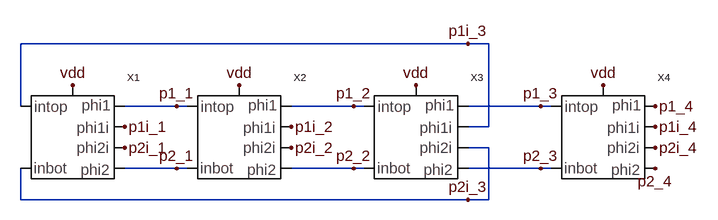
[diagram p0: schematic clock_gen.asc]
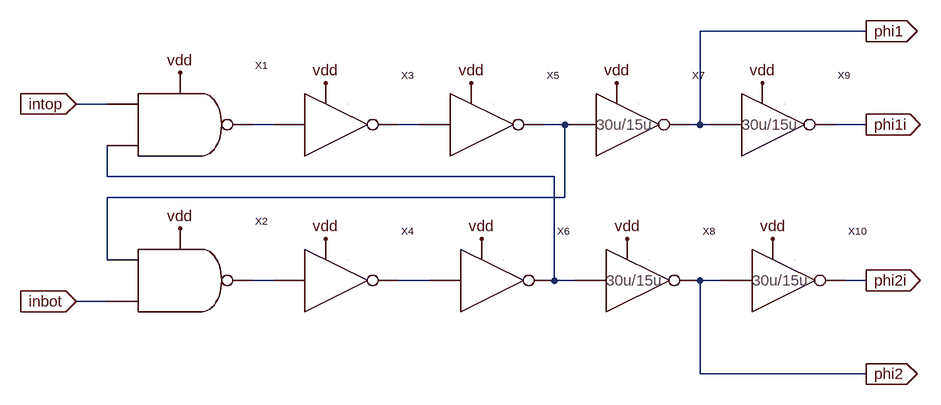
[diagram p1: sub-circuit delay.asc]
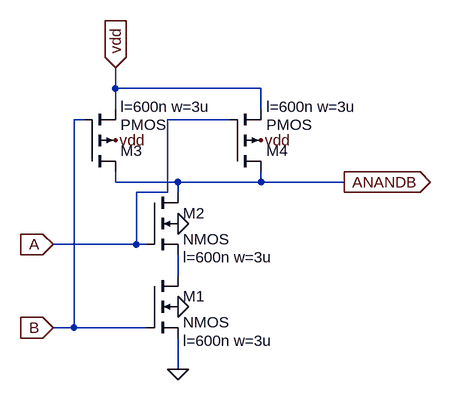
[diagram p2: sub-circuit nand_2.asc]
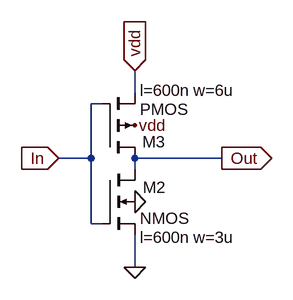
[diagram p3: sub-circuit inv_6u_3u.asc]
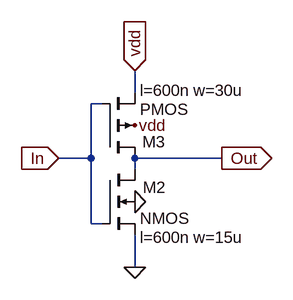
[diagram p4: sub-circuit inv_30u_15u.asc]
clock_gen.asc, the LTspice schematic file:
Version 4
SHEET 1 1048 680
WIRE 672 32 -16 32
WIRE 704 32 672 32
WIRE 704 160 704 32
WIRE -16 128 -16 32
WIRE 224 128 144 128
WIRE 240 128 224 128
WIRE 496 128 400 128
WIRE 512 128 496 128
WIRE 784 128 672 128
WIRE 800 128 784 128
WIRE 704 160 672 160
WIRE 704 192 672 192
WIRE 224 224 144 224
WIRE 240 224 224 224
WIRE 496 224 400 224
WIRE 512 224 496 224
WIRE 784 224 672 224
WIRE 800 224 784 224
WIRE -16 272 -16 224
WIRE 672 272 -16 272
WIRE 704 272 704 192
WIRE 704 272 672 272
FLAG 64 96 vdd
FLAG 320 96 vdd
FLAG 592 96 vdd
FLAG 880 96 vdd
FLAG 224 128 p1_1
FLAG 496 128 p1_2
FLAG 784 128 p1_3
FLAG 960 128 p1_4
FLAG 144 160 p1i_1
FLAG 400 160 p1i_2
FLAG 672 32 p1i_3
FLAG 960 160 p1i_4
FLAG 144 192 p2i_1
FLAG 400 192 p2i_2
FLAG 672 272 p2i_3
FLAG 960 192 p2i_4
FLAG 224 224 p2_1
FLAG 496 224 p2_2
FLAG 784 224 p2_3
FLAG 960 224 p2_4
SYMBOL delay 64 176 R0
SYMATTR InstName X1
SYMBOL delay 320 176 R0
SYMATTR InstName X2
SYMBOL delay 592 176 R0
SYMATTR InstName X3
SYMBOL delay 880 176 R0
SYMATTR InstName X4

delay.asc, the sub-circuit schematic file:
Version 4
SHEET 1 1340 680
WIRE 1216 -16 960 -16
WIRE 48 96 0 96
WIRE 304 128 272 128
WIRE 528 128 496 128
WIRE 752 128 720 128
WIRE 960 128 960 -16
WIRE 960 128 944 128
WIRE 976 128 960 128
WIRE 1216 128 1168 128
WIRE 48 208 48 160
WIRE 736 208 48 208
WIRE 752 240 752 128
WIRE 752 240 48 240
WIRE 48 336 48 240
WIRE 304 368 272 368
WIRE 544 368 496 368
WIRE 736 368 736 208
WIRE 768 368 736 368
WIRE 992 368 960 368
WIRE 1216 368 1184 368
WIRE 48 400 0 400
WIRE 960 512 960 368
WIRE 1216 512 960 512
FLAG 384 64 vdd
FLAG 160 48 vdd
FLAG 608 64 vdd
FLAG 624 304 vdd
FLAG 384 304 vdd
FLAG 160 288 vdd
FLAG 832 64 vdd
FLAG 1056 64 vdd
FLAG 848 304 vdd
FLAG 1072 304 vdd
FLAG 1216 -16 phi1
IOPIN 1216 -16 Out
FLAG 1216 128 phi1i
IOPIN 1216 128 Out
FLAG 1216 368 phi2i
IOPIN 1216 368 Out
FLAG 1216 512 phi2
IOPIN 1216 512 Out
FLAG 0 96 intop
IOPIN 0 96 In
FLAG 0 400 inbot
IOPIN 0 400 In
SYMBOL NAND_2 80 128 R0
SYMATTR InstName X1
SYMBOL NAND_2 80 368 R0
SYMATTR InstName X2
SYMBOL Inv_6u_3u 304 128 R0
SYMATTR InstName X3
SYMBOL Inv_6u_3u 304 368 R0
SYMATTR InstName X4
SYMBOL Inv_6u_3u 528 128 R0
SYMATTR InstName X5
SYMBOL Inv_6u_3u 544 368 R0
SYMATTR InstName X6
SYMBOL Inv_30u_15u 752 128 R0
SYMATTR InstName X7
SYMBOL Inv_30u_15u 768 368 R0
SYMATTR InstName X8
SYMBOL Inv_30u_15u 976 128 R0
SYMATTR InstName X9
SYMBOL Inv_30u_15u 992 368 R0
SYMATTR InstName X10

nand_2.asc, the sub-circuit schematic file:
Version 4
SHEET 1 880 680
WIRE 176 -96 176 -128
WIRE 400 -96 176 -96
WIRE 176 -64 176 -96
WIRE 400 -64 400 -96
WIRE 128 -48 112 -48
WIRE 352 -48 256 -48
WIRE 176 48 176 32
WIRE 272 48 176 48
WIRE 400 48 400 32
WIRE 400 48 272 48
WIRE 528 48 400 48
WIRE 256 64 256 -48
WIRE 256 64 208 64
WIRE 272 64 272 48
WIRE 208 144 208 64
WIRE 208 144 80 144
WIRE 224 144 208 144
WIRE 272 192 272 160
WIRE 112 272 112 -48
WIRE 112 272 80 272
WIRE 224 272 112 272
WIRE 272 336 272 288
FLAG 272 336 0
FLAG 272 240 0
FLAG 272 112 0
FLAG 80 144 A
IOPIN 80 144 In
FLAG 80 272 B
IOPIN 80 272 In
FLAG 176 -128 vdd
IOPIN 176 -128 In
FLAG 176 -16 vdd
FLAG 400 -16 vdd
FLAG 528 48 ANANDB
IOPIN 528 48 Out
SYMBOL nmos4 224 192 R0
WINDOW 123 56 100 Left 2
SYMATTR InstName M1
SYMATTR Value2 l=600n w=3u
SYMBOL nmos4 224 64 R0
WINDOW 123 56 100 Left 2
SYMATTR InstName M2
SYMATTR Value2 l=600n w=3u
SYMBOL pmos4 128 32 M180
WINDOW 123 56 100 Left 2
SYMATTR InstName M3
SYMATTR Value2 l=600n w=3u
SYMBOL pmos4 352 32 M180
WINDOW 123 56 100 Left 2
SYMATTR InstName M4
SYMATTR Value2 l=600n w=3u

inv_6u_3u.asc, the sub-circuit schematic file:
Version 4
SHEET 1 880 680
WIRE 272 -48 272 -80
WIRE 224 -32 208 -32
WIRE 208 48 208 -32
WIRE 208 48 160 48
WIRE 400 48 272 48
WIRE 272 64 272 48
WIRE 208 144 208 48
WIRE 224 144 208 144
WIRE 272 208 272 160
FLAG 272 208 0
FLAG 272 112 0
FLAG 160 48 In
IOPIN 160 48 In
FLAG 272 -80 vdd
IOPIN 272 -80 In
FLAG 272 0 vdd
FLAG 400 48 Out
IOPIN 400 48 Out
SYMBOL nmos4 224 64 R0
WINDOW 123 56 100 Left 2
WINDOW 0 60 27 Left 2
SYMATTR Value2 l=600n w=3u
SYMATTR InstName M2
SYMBOL pmos4 224 48 M180
WINDOW 123 56 100 Left 2
WINDOW 0 59 24 Left 2
SYMATTR Value2 l=600n w=6u
SYMATTR InstName M3

inv_30u_15u.asc, the sub-circuit schematic file:
Version 4
SHEET 1 880 680
WIRE 272 -48 272 -80
WIRE 224 -32 208 -32
WIRE 208 48 208 -32
WIRE 208 48 160 48
WIRE 400 48 272 48
WIRE 272 64 272 48
WIRE 208 144 208 48
WIRE 224 144 208 144
WIRE 272 208 272 160
FLAG 272 208 0
FLAG 272 112 0
FLAG 160 48 In
IOPIN 160 48 In
FLAG 272 -80 vdd
IOPIN 272 -80 In
FLAG 272 0 vdd
FLAG 400 48 Out
IOPIN 400 48 Out
SYMBOL nmos4 224 64 R0
WINDOW 123 56 100 Left 2
WINDOW 0 60 27 Left 2
SYMATTR Value2 l=600n w=15u
SYMATTR InstName M2
SYMBOL pmos4 224 48 M180
WINDOW 123 56 100 Left 2
WINDOW 0 59 24 Left 2
SYMATTR Value2 l=600n w=30u
SYMATTR InstName M3

The netlist it stands for:
* clock_gen.asc
XX1 p1i_3 p2i_3 p1_1 p1i_1 p2i_1 p2_1 vdd delay
XX2 p1_1 p2_1 p1_2 p1i_2 p2i_2 p2_2 vdd delay
XX3 p1_2 p2_2 p1_3 p1i_3 p2i_3 p2_3 vdd delay
XX4 p1_3 p2_3 p1_4 p1i_4 p2i_4 p2_4 vdd delay

* block symbol definitions
.subckt delay intop inbot phi1 phi1i phi2i phi2 vdd
XX1 intop N004 N001 vdd nand_2
XX2 N003 inbot N005 vdd nand_2
XX3 N001 N002 vdd inv_6u_3u
XX4 N005 N006 vdd inv_6u_3u
XX5 N002 N003 vdd inv_6u_3u
XX6 N006 N004 vdd inv_6u_3u
XX7 N003 phi1 vdd inv_30u_15u
XX8 N004 phi2 vdd inv_30u_15u
XX9 phi1 phi1i vdd inv_30u_15u
XX10 phi2 phi2i vdd inv_30u_15u
.ends delay

.subckt nand_2 A B ANANDB vdd
M1 N001 B 0 0 NMOS l=600n w=3u
M2 ANANDB A N001 0 NMOS l=600n w=3u
M3 ANANDB B vdd vdd PMOS l=600n w=3u
M4 ANANDB A vdd vdd PMOS l=600n w=3u
.ends nand_2

.subckt inv_6u_3u In Out vdd
M2 Out In 0 0 NMOS l=600n w=3u
M3 Out In vdd vdd PMOS l=600n w=6u
.ends inv_6u_3u

.subckt inv_30u_15u In Out vdd
M2 Out In 0 0 NMOS l=600n w=15u
M3 Out In vdd vdd PMOS l=600n w=30u
.ends inv_30u_15u

.model NMOS NMOS
.model PMOS PMOS
.lib standard.mos
.backanno
.end